# EAGLE design Cursor-EC60 (EAGLE 7.4.1)
Cursor Keypad Simple 5 Button cursor keys for use inside an ALPR EC60A/B encoder ring. The cursor keys sit on an board that has to be suspenden by an 3D Printed frame. 4 3.2mm mounting holes are for this.
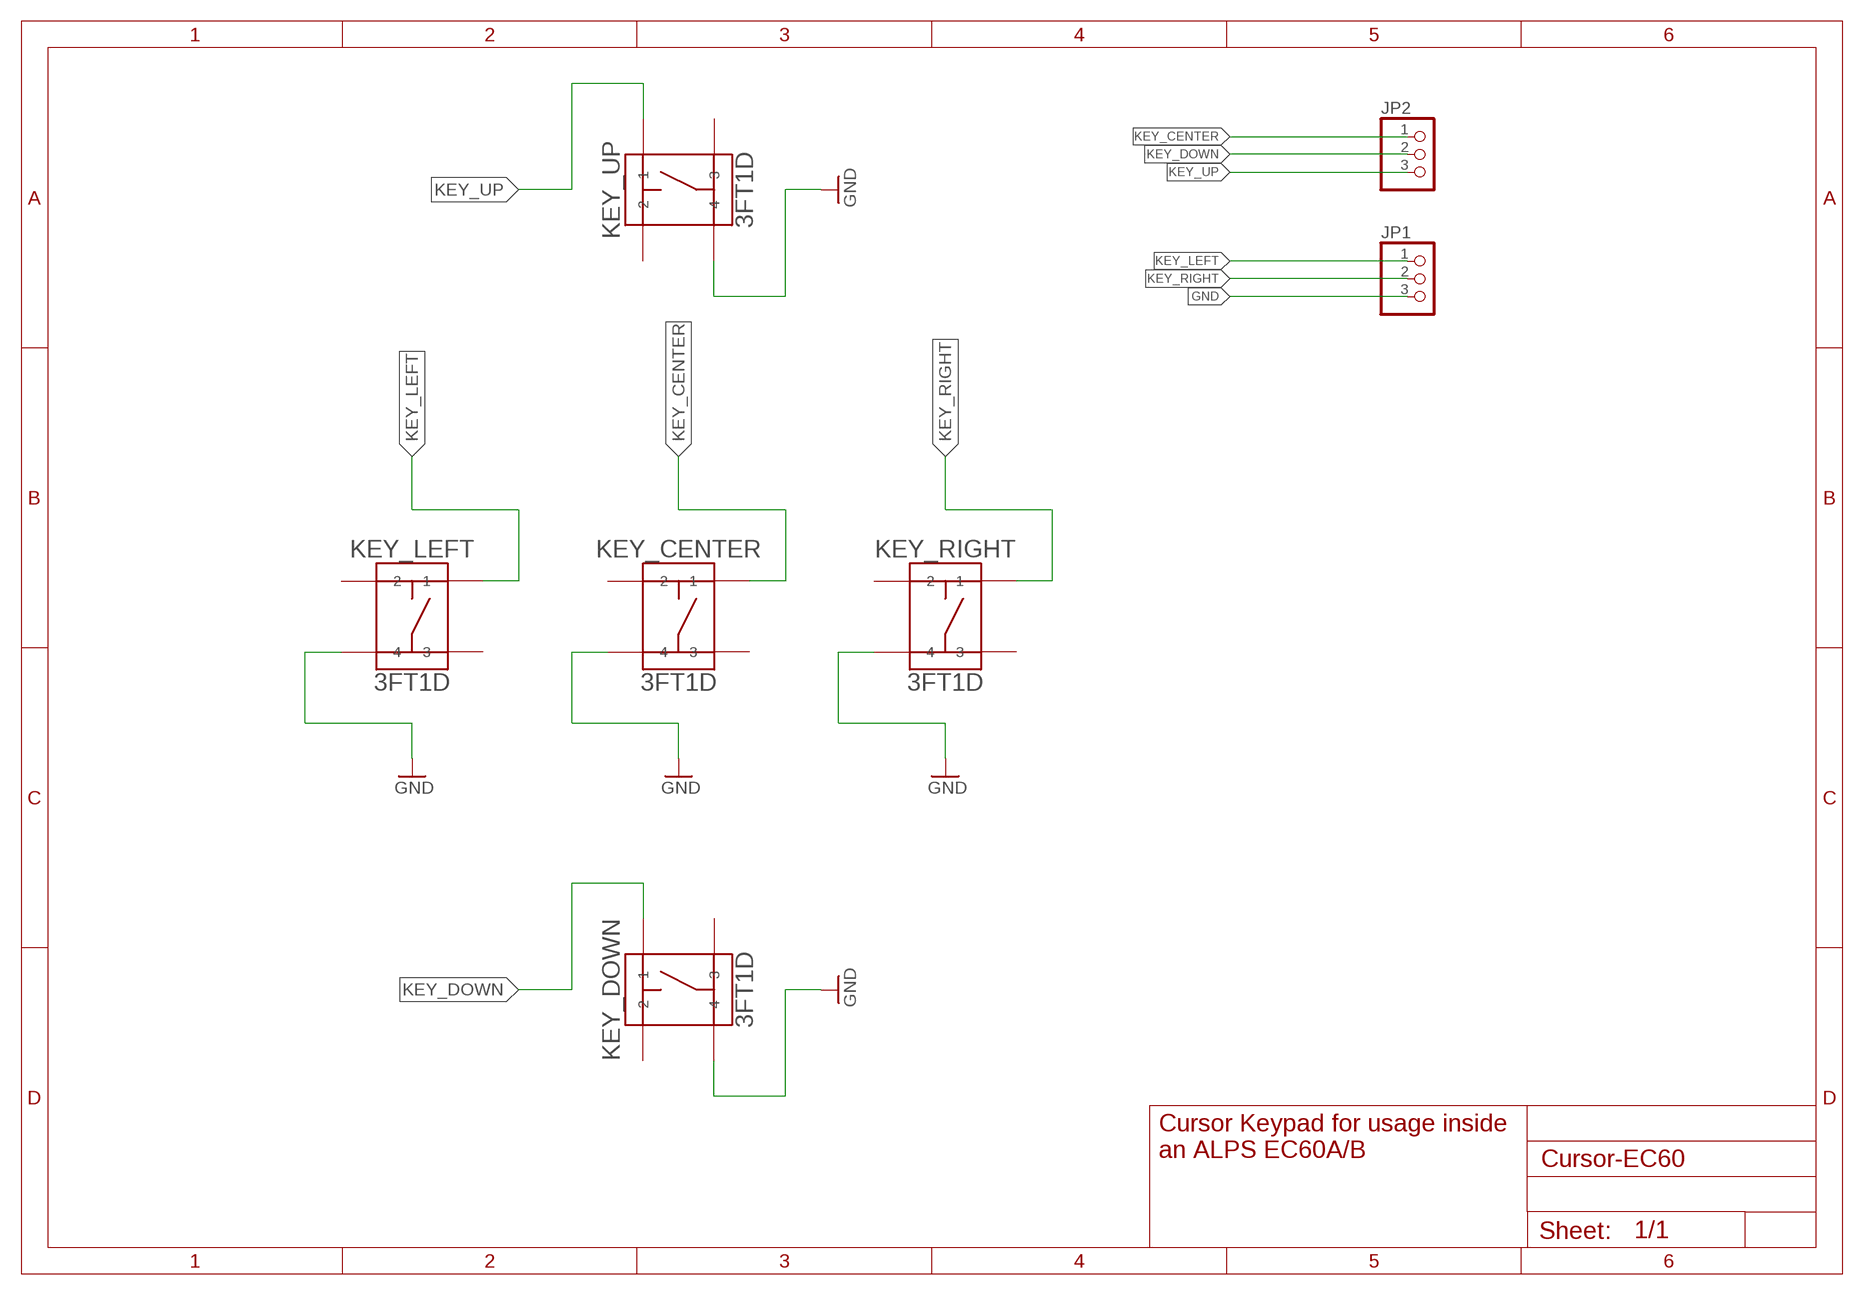
[diagram p0: schematic, sheet 1]

## Parts
JP1  PINHD-1X3  [1X03]
JP2  PINHD-1X3  [1X03]
KEY_CENTER  3FT1D  [3FT]
KEY_DOWN  3FT1D  [3FT]
KEY_LEFT  3FT1D  [3FT]
KEY_RIGHT  3FT1D  [3FT]
KEY_UP  3FT1D  [3FT]

## Nets
GND [Supply]: JP1.3 KEY_CENTER.P$4 KEY_DOWN.P$4 KEY_LEFT.P$4 KEY_RIGHT.P$4 KEY_UP.P$4
KEY_CENTER [Supply]: JP2.1 KEY_CENTER.P$1
KEY_DOWN [Supply]: JP2.2 KEY_DOWN.P$1
KEY_LEFT [Supply]: JP1.1 KEY_LEFT.P$1
KEY_RIGHT [Supply]: JP1.2 KEY_RIGHT.P$1
KEY_UP [Supply]: JP2.3 KEY_UP.P$1
Unconnected: KEY_CENTER.P$2 KEY_CENTER.P$3 KEY_DOWN.P$2 KEY_DOWN.P$3 KEY_LEFT.P$2 KEY_LEFT.P$3 KEY_RIGHT.P$2 KEY_RIGHT.P$3 KEY_UP.P$2 KEY_UP.P$3

## Notes on the sheet
- Cursor Keypad for usage inside
  an ALPS EC60A/B

## Library data of the parts
JP1 JP2 = pinhead:PINHD-1X3: PIN HEADER
KEY_CENTER KEY_DOWN KEY_LEFT KEY_RIGHT KEY_UP = mec switches:3FT1D: Mulitmec - 3FT1D <http://www.mec.dk/statisk.php4?id=504> Switch 3F - Through Hole with basic matt cover http://www.mec.dk

## Net classes
0 default: width 0.406 mm
1 Supply: width 0.61 mm

## Board
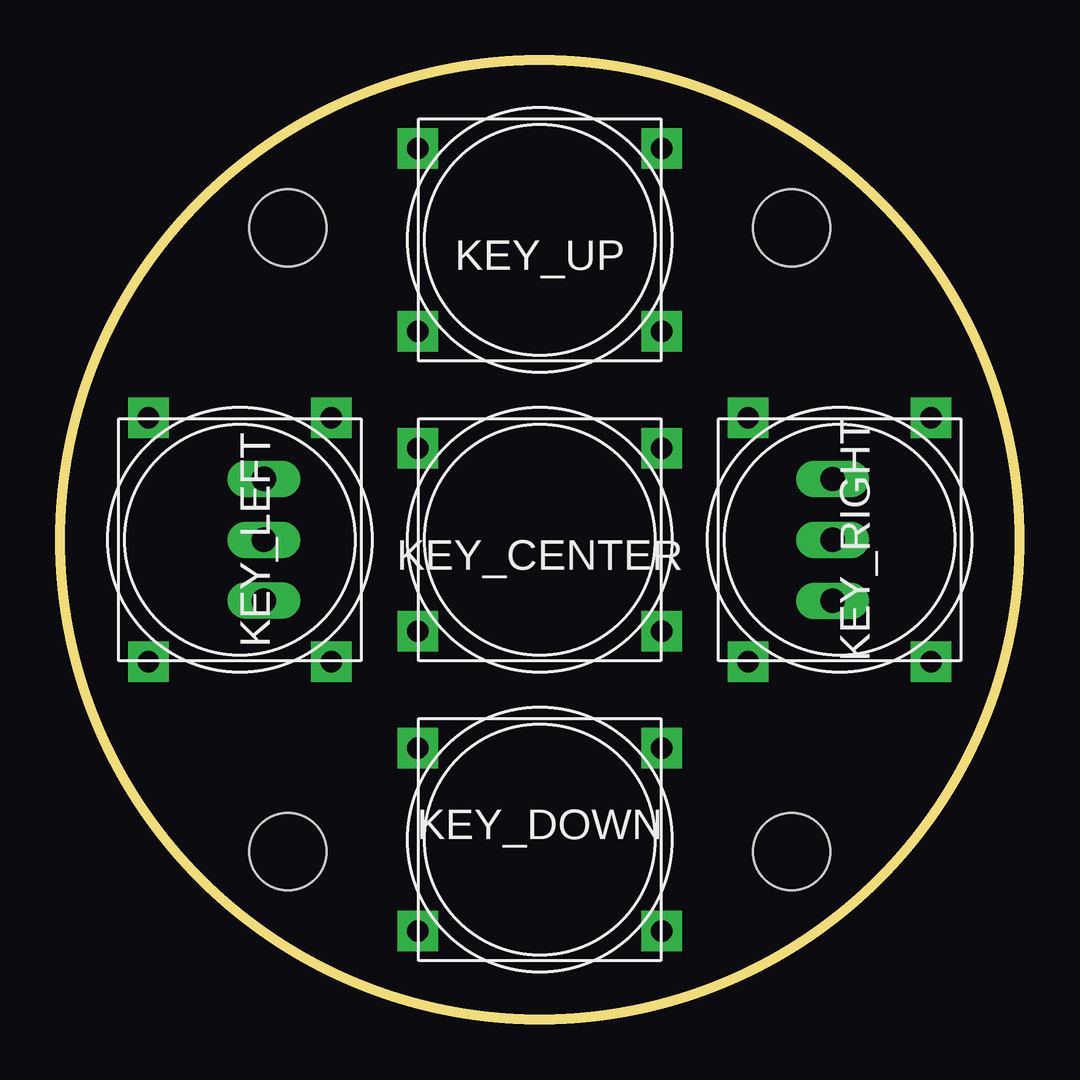
[diagram p1: board, top side]
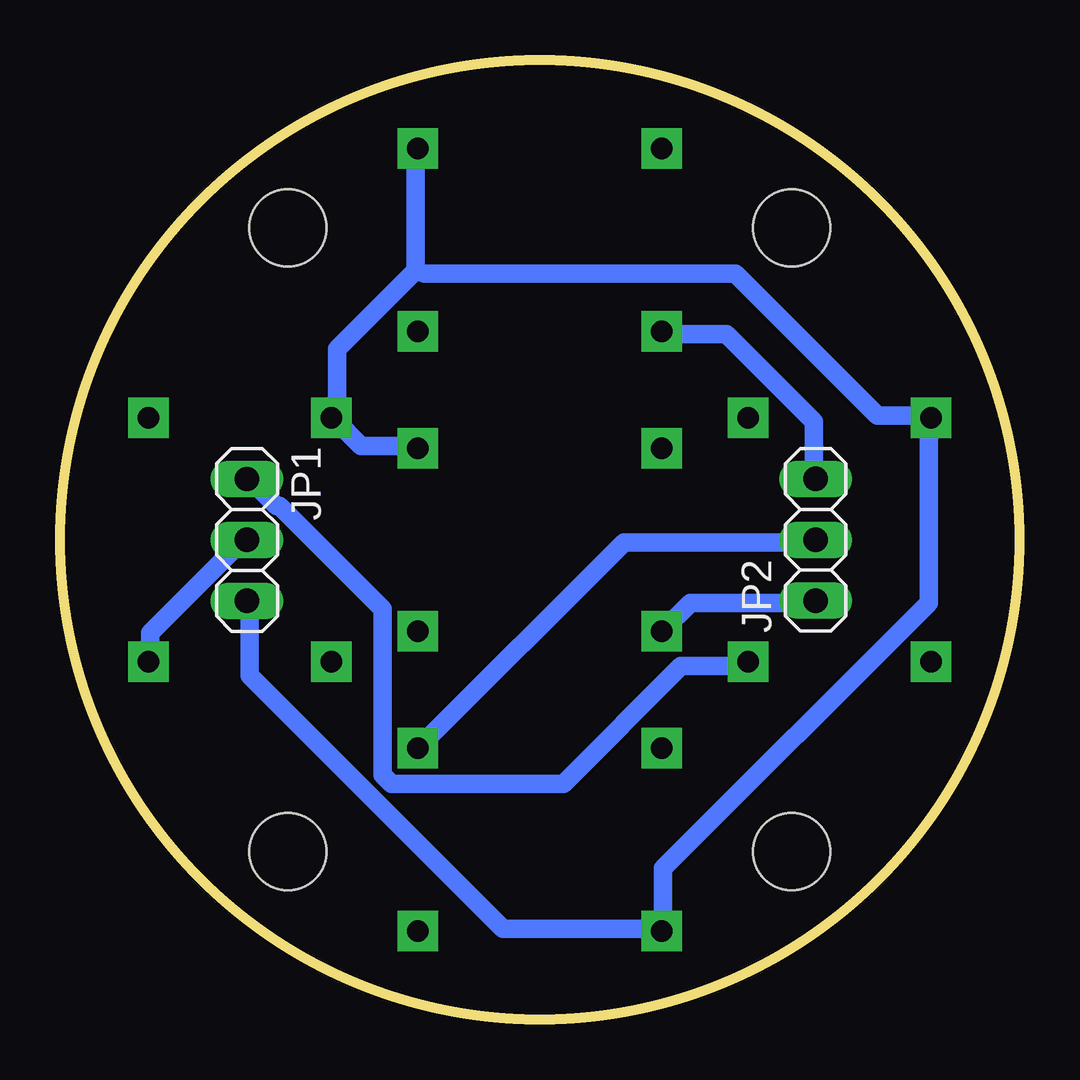
[diagram p2: board, bottom side, seen from below]

Size 40 x 40 mm. Coordinates in mm from the lower left corner, seen from the top.
Outline: circle at 20,20 radius 20
Copper layers (1*16): Top 0.035mm / dielectric 1.5mm / Bottom 0.035mm
Design rules "default": minimum track width 10mil, minimum drill 24mil, track to track 8mil, track to pad 8mil, pad to pad 8mil, via to via 8mil, smd to smd 8mil, copper to edge 40mil, drill to drill 8mil, minimum pad ring 10mil, minimum via ring 8mil, stop-mask expansion 4mil, vias tented up to drill 0mil, thermal gap 10mil
Holes 3.2 mm at 9.5,33 30.5,7 30.5,33 9.5,7

### Footprints (pad centres in the part's own frame; a part is rotated, then mirrored left to right if it is on the bottom)
1X03 = drill 1.016 long: 1 -2.54,0; 2 0,0; 3 2.54,0
3FT = drill 0.9 pad 1.676 square: P$1 5.08,3.81; P$2 -5.08,3.81; P$3 5.08,-3.81; P$4 -5.08,-3.81

### Placement (x,y rotation side)
JP1  32.21,19.99 270 bottom
JP2  8.5,20 90 bottom
KEY_CENTER  20,20 180 top
KEY_DOWN  20,7.5 0 top
KEY_LEFT  7.5,20 270 top
KEY_RIGHT  32.5,20 270 top
KEY_UP  20,32.5 180 top

### Tracks (layer width: path | path; a pad name or v marks a point on that pad's centre or on a via)
GND
  Bottom 0.762: KEY_CENTER.P$4 25.18,23.91 27.44,23.91 28.57,25.05 KEY_RIGHT.P$4 28.45,25.42 28.45,27.94 25.18,31.21 | 25.18,31.21 25.18,36.24 KEY_UP.P$4 | JP1.3 32.09,17.37 32.09,14.35 21.53,3.79 14.99,3.79 KEY_DOWN.P$4 14.86,4.16 14.86,6.3 3.79,17.37 3.79,25.05 KEY_LEFT.P$4 4.17,25.17 5.93,25.17 11.84,31.09 24.8,31.09 25.18,31.21
KEY_CENTER
  Bottom 0.762: JP2.1 8.57,17.37 13.73,17.37 14.86,16.24 KEY_CENTER.P$1
KEY_DOWN
  Bottom 0.762: JP2.2 8.57,19.89 16.5,19.89 25.05,11.34 KEY_DOWN.P$1
KEY_LEFT
  Bottom 0.762: JP1.1 32.09,22.53 30.96,21.4 30.84,21.4 26.56,17.12 26.56,10.2 26.18,9.82 19.01,9.82 14.11,14.73 11.46,14.73 11.34,14.86 KEY_LEFT.P$1
KEY_RIGHT
  Bottom 0.762: JP1.2 32.22,19.89 32.47,19.89 36.25,16.11 36.25,14.98 KEY_RIGHT.P$1
KEY_UP
  Bottom 0.762: JP2.3 8.57,22.66 8.57,24.92 12.22,28.57 14.86,28.57 KEY_UP.P$1